# Altium project STM_System_Board.PrjPCB (part 4 of 6)

## Sheet STM_System_Board_Supply.SchDoc
size 420 x 297 mm; EDA_Number: ARTIQ; Author: G.Kasprowicz, P. Kulik; CompanyName: WUT ISE; DrawnBy: G.Kasprowicz, P. Kulik; Organization: WUT ISE; DocumentNumber: 9; SheetNumber: 9; ModifiedBy: -; CheckedDate: -; Title2: Power supply; Designer: G.Kasprowicz, P. Kulik; ModifiedDate: -; ProjectName: Sensor Box
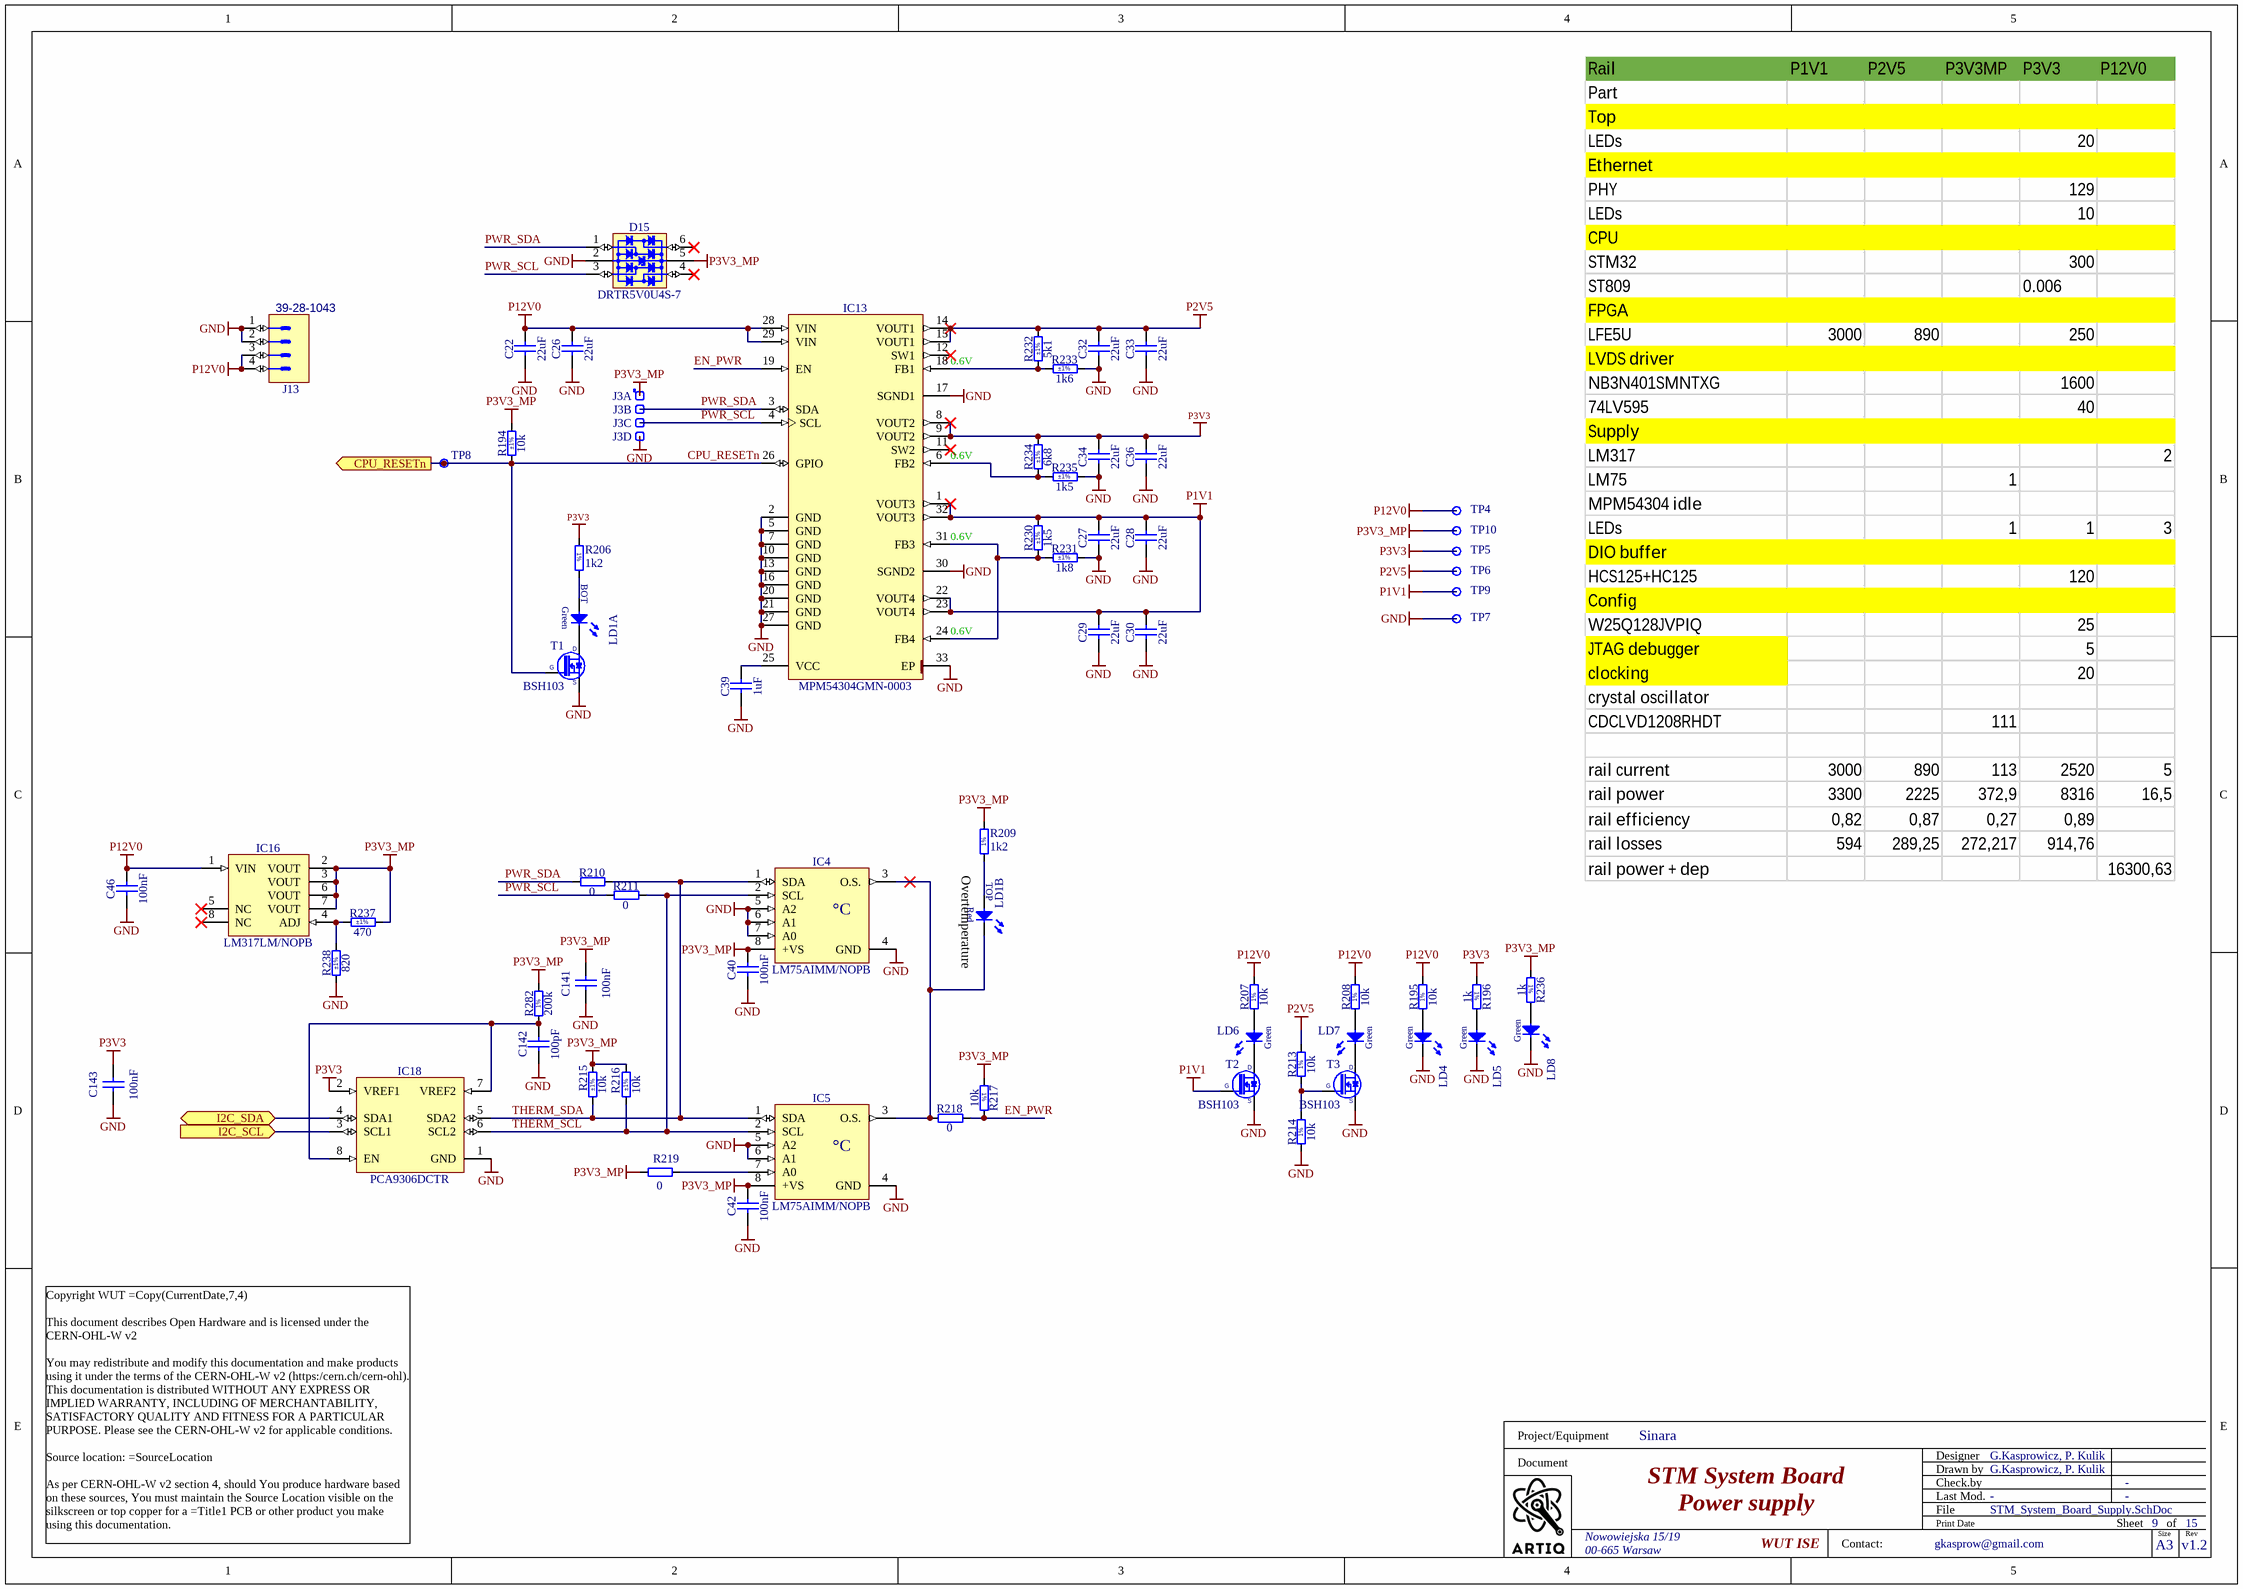
[diagram p6: STM_System_Board_Supply.SchDoc]

### Parts
C22  22uF  [CAPC2012X135N]
C26  22uF  [CAPC2012X135N]
C27  22uF  [CAPC2012X135N]
C28  22uF  [CAPC2012X135N]
C29  22uF  [CAPC2012X135N]
C30  22uF  [CAPC2012X135N]
C32  22uF  [CAPC2012X135N]
C33  22uF  [CAPC2012X135N]
C34  22uF  [CAPC2012X135N]
C36  22uF  [CAPC2012X135N]
C39  1uF  [CAPC1005X55N]
C40  100nF  [CAPC1005X55N]
C42  100nF  [CAPC1005X55N]
C46  100nF  [CAPC1005X55N]
C141  100nF  [CAPC1005X55N]
C142  100pF  [CAPC1005X55N]
C143  100nF  [CAPC1005X55N]
D15  DRTR5V0U4S-7  [SOT65P210X110-6N]
IC4  LM75AIMM/NOPB  [SOP65P490X109-8N]
IC5  LM75AIMM/NOPB  [SOP65P490X109-8N]
IC13  MPM54304GMN-0003  [MPS_MPM54304GMN]
IC16  LM317LM/NOPB  [SOIC127P600X175-8N]
IC18  PCA9306DCTR  [SOP65P400X130-8N]
J3  Header 4  [SAMTEC_HTSW-104-23-L-S]  (value not drawn)  (parts A,B,C,D of 4)
J13  Manufacturer Part Number: 39-28-1043  [MOLEX_39-28-1043]  (hidden comment: Mini-Fit Jr.™)
LD1  Red/Green  [LED_DIALIGHT_571-0112F]  (value not drawn)  (parts A,B of 2)
LD4  Green  [LED_KINGBRIGHT_KPH-1608CGCK]
LD5  Green  [LED_KINGBRIGHT_KPH-1608CGCK]
LD6  Green  [LED_KINGBRIGHT_KPH-1608CGCK]
LD7  Green  [LED_KINGBRIGHT_KPH-1608CGCK]
LD8  Green  [LED_KINGBRIGHT_KPH-1608CGCK]
R194  10k  Tolerance: ±1%  [RESC1005X40N]
R195  10k  [RESC1005X40N]
R196  1k  [RESC1608X55N]
R206  1k2  [RESC1608X55N]
R207  10k  [RESC1005X40N]
R208  10k  [RESC1005X40N]
R209  1k2  [RESC1608X55N]
R210  0  [RESC1005X40N]
R211  0  [RESC1005X40N]
R213  10k  [RESC1005X40N]
R214  10k  [RESC1005X40N]
R215  10k  Tolerance: ±1%  [RESC1005X40N]
R216  10k  Tolerance: ±1%  [RESC1005X40N]
R217  10k  [RESC1005X40N]
R218  0  [RESC1005X40N]
R219  0  [RESC1005X40N]
R230  1k5  Tolerance: ±1%  [RESC1005X40N]
R231  1k8  Tolerance: ±1%  [RESC1005X40N]
R232  5k1  Tolerance: ±1%  [RESC1005X40N]
R233  1k6  Tolerance: ±1%  [RESC1005X40N]
R234  6k8  Tolerance: ±1%  [RESC1005X40N]
R235  1k5  Tolerance: ±1%  [RESC1005X40N]
R236  1k  [RESC1608X55N]
R237  470  Tolerance: ±1%  [RESC1005X40N]
R238  820  Tolerance: ±1%  [RESC1005X40N]
R282  200k  [RESC1005X40N]
T1  BSH103  [SOT95P230X110-3N]
T2  BSH103  [SOT95P230X110-3N]
T3  BSH103  [SOT95P230X110-3N]
TP4  Test Point  [TPS127]  (value not drawn)
TP5  Test Point  [TPS127]  (value not drawn)
TP6  Test Point  [TPS127]  (value not drawn)
TP7  Test Point  [TPS127]  (value not drawn)
TP8  Test Point  [TPS127]  (value not drawn)
TP9  Test Point  [TPS127]  (value not drawn)
TP10  Test Point  [TPS127]  (value not drawn)

### Ports
CPU_RESETn (out), I2C_SCL (in), I2C_SDA (bidir)

### Nets
GND: C22.1 C26.1 C27.1 C28.1 C29.1 C30.1 C32.1 C33.1 C34.1 C36.1 C39.1 C40.1 C42.1 C46.1 C141.1 C142.1 C143.1 D15.2(GND) IC4.4(GND) IC4.5(A2) IC4.6(A1) IC4.7(A0) IC5.4(GND) IC5.5(A2) IC5.6(A1) IC13.2(GND) IC13.5(GND) IC13.7(GND) IC13.10(GND) IC13.13(GND) IC13.16(GND) IC13.17(SGND1) IC13.20(GND) IC13.21(GND) IC13.27(GND) IC13.30(SGND2) IC13.33(EP) IC18.1(GND) J3.4 J13.1 J13.2 LD4.1(C) LD5.1(C) LD8.1(C) R214.1 R231.2 R233.2 R235.2 R238.1 T1.2(S) T2.2(S) T3.2(S) TP7.1
P1V1: C27.2 C28.2 C29.2 C30.2 IC13.1(VOUT3) IC13.22(VOUT4) IC13.23(VOUT4) IC13.32(VOUT3) R230.2 T2.1(G) TP9.1
P2V5: C32.2 C33.2 IC13.14(VOUT1) IC13.15(VOUT1) R213.2 R232.2 TP6.1
P3V3: C34.2 C36.2 C143.2 IC13.8(VOUT2) IC13.9(VOUT2) IC18.2(VREF1) R196.1 R206.1 R234.2 TP5.1
P3V3_MP: C40.2 C42.2 C141.2 D15.5(VBUS) IC4.8(+VS) IC5.8(+VS) IC16.2(VOUT) IC16.3(VOUT) IC16.6(VOUT) IC16.7(VOUT) J3.1 R194.2 R209.2 R215.2 R216.2 R217.1 R219.1 R236.1 R237.2 R282.2 TP10.1
P12V0: C22.2 C26.2 C46.2 IC13.28(VIN) IC13.29(VIN) IC16.1(VIN) J13.3 J13.4 R195.2 R207.2 R208.2 TP4.1
CPU_RESETn: IC13.26(GPIO) R194.1 T1.1(G) TP8.1 ; port CPU_RESETn
EN_PWR: IC13.19(EN) R217.2 R218.2
I2C1_SCL: IC18.3(SCL1) ; port I2C_SCL
I2C1_SDA: IC18.4(SDA1) ; port I2C_SDA
PWR_SCL: D15.3(I/O2) IC13.4(SCL) J3.3 R211.1
PWR_SDA: D15.1(I/O1) IC13.3(SDA) J3.2 R210.1
THERM_SCL: IC4.2(SCL) IC5.2(SCL) IC18.6(SCL2) R211.2 R216.1
THERM_SDA: IC4.1(SDA) IC5.1(SDA) IC18.5(SDA2) R210.2 R215.1
NetC39_2: C39.2 IC13.25(VCC)
NetC142_2: C142.2 IC18.7(VREF2) IC18.8(EN) R282.1
NetIC4_3: IC4.3(O.S.) IC5.3(O.S.) LD1.3(C) R218.1
NetIC5_7: IC5.7(A0) R219.2
NetIC13_6: IC13.6(FB2) R234.1 R235.1
NetIC13_18: IC13.18(FB1) R232.1 R233.1
NetIC13_24: IC13.24(FB4) IC13.31(FB3) R230.1 R231.1
NetIC16_4: IC16.4(ADJ) R237.1 R238.2
NetLD1_1: LD1.1(C) T1.3(D)
NetLD1_2: LD1.2(A) R206.2
NetLD1_4: LD1.4(A) R209.1
NetLD4_2: LD4.2(A) R195.1
NetLD5_2: LD5.2(A) R196.2
NetLD6_1: LD6.1(C) T2.3(D)
NetLD6_2: LD6.2(A) R207.1
NetLD7_1: LD7.1(C) T3.3(D)
NetLD7_2: LD7.2(A) R208.1
NetLD8_2: LD8.2(A) R236.2
NetR213_1: R213.1 R214.2 T3.1(G)

Not connected (* = marked no-connect by the designer): D15 4(I/O3)* 6(I/O4)*; IC13 11(SW2)* 12(SW1)*; IC16 5(NC)* 8(NC)*

### Notes on the sheet
- (near IC13) 0.6V
- (near LD1) Overtemperature
- Project/Equipment
- Document
- Designer
- Drawn by
- Check.by
- Copyright WUT =Copy(CurrentDate,7,4)
  This document describes Open Hardware and is licensed under the CERN-OHL-W v2
  You may redistribute and modify this documentation and make products using it under the terms of the CERN-OHL-W v2 (https:/cern.ch/cern-ohl). This documentation is distributed WITHOUT ANY EXPRESS OR IMPLIED WARRANTY, INCLUDING OF MERCHANTABILITY, SATISFACTORY QUALITY AND FITNESS FOR A PARTICULAR PURPOSE. Please see the CERN-OHL-W v2 for applicable conditions.
  Source location: =SourceLocation
  As per CERN-OHL-W v2 section 4, should You produce hardware based on these sources, You must maintain the Source Location visible on the silkscreen or top copper for a =Title1 PCB or other product you make using this documentation.
- Contact:
- File
- Last Mod.
- Print Date
- Sheet
- Size
- A3
- of
- Rev
- (in symbol LED_DIALIGHT_571-0112F, part A) BOT; Green
- (in symbol LED_DIALIGHT_571-0112F, part B) TOP; Red
- (in symbol LM75AIMM/NOPB) °C
- (in symbol R0402_10K_1%_0.0625W_100PPM) 1%
- (in symbol R0402_10k_1%_0.0625W_100PPM) 1%
- (in symbol R0402_200K_1%_0.0625W_100PPM) 1%
- (in symbol R0603_1K2_1%_0.1W_100PPM) 1%
- (in symbol R0603_1K_1%_0.1W_100PPM) 1%

### Library data of the parts
C22 C26-C30 C32-C34 C36 = CC0805_22UF_16V_10%_X5R: Non-polarised capacitor; Part Description: SMD Multilayer Chip Ceramic Capacitor; Manufacturer: GENERIC; Manufacturer1 Part Number: C2012X5R1C226KT; Voltage: 16V; TC: X5R; Tolerance: ±10%; Part Number: CC0805_22UF_16V_10%_X5R; Component Kind: Standard; Component Type: Standard; Pin Count: 2; Value: 22uF; Status: Preferred; Manufacturer Part Number: CC0805_22UF_16V_10%_X5R; Case: 0805; Mounted: Yes; Socket: No; SMD: Yes; Sense: No; Manufacturer1 Example: TDK; Manufacturer1 ComponentHeight: 1.35mm; HelpURL: \\cern.ch\dfs\Applications\Altium\Datasheets\CC0805_X5R_TDK_C.pdf; Author: CERN DEM JLC; CreateDate: 25.10.2012; LatestRevisionDate: 25.10.2012
C39 = CC0402_1UF_16V_10%_X5R: Non-polarised capacitor; Part Description: SMD Multilayer Chip Ceramic Capacitor; Manufacturer: GENERIC; Manufacturer1 Part Number: C1005X5R1C105KT; Voltage: 16V; TC: X5R; Tolerance: ±10%; Part Number: CC0402_1UF_16V_10%_X5R; Component Kind: Standard; Component Type: Standard; Pin Count: 2; Value: 1uF; Status: Preferred; Manufacturer Part Number: CC0402_1UF_16V_10%_X5R; Case: 0402; Mounted: Yes; Socket: No; SMD: Yes; Sense: No; Manufacturer1 Example: TDK; Manufacturer1 ComponentHeight: 0.55mm; HelpURL: \\cern.ch\dfs\Applications\Altium\Datasheets\CC0402_X5R_TDK_C.pdf; Author: CERN DEM JLC; CreateDate: 2012-10-25; LatestRevisionDate: 2012-10-25
C40 C42 C46 C141 C143 = CC0402_100NF_16V_10%_X5R: Non-polarised capacitor; Part Description: SMD Multilayer Chip Ceramic Capacitor; Manufacturer: GENERIC; Manufacturer1 Part Number: GRM155R61C104KA88D; Voltage: 16V; TC: X5R; Tolerance: ±10%; Part Number: CC0402_100NF_16V_10%_X5R; Component Kind: Standard; Component Type: Standard; Pin Count: 2; Value: 100nF; Status: None; Manufacturer Part Number: CC0402_100NF_16V_10%_X5R; Case: 0402; Mounted: Yes; Socket: No; SMD: Yes; Sense: No; Manufacturer1 Example: MURATA; Manufacturer1 ComponentHeight: 0.55mm; HelpURL: \\cern.ch\dfs\Applications\Altium\Datasheets\CC0402_X5R_MURATA_GRM.pdf; Author: CERN DEM JLC; CreateDate: 10.12.2013; LatestRevisionDate: 10.12.2013
C142 = CC0402_100PF_50V_5%_C0G: Non-polarised capacitor; Part Description: SMD Multilayer Chip Ceramic Capacitor; Manufacturer: GENERIC; Manufacturer1 Part Number: C0402C101J5GACTU; Voltage: 50V; TC: C0G/NP0; Tolerance: ±5%; Part Number: CC0402_100PF_50V_5%_C0G; Component Kind: Standard; Component Type: Standard; Pin Count: 2; Value: 100pF; Status: Preferred; Manufacturer Part Number: CC0402_100PF_50V_5%_C0G; Case: 0402; Mounted: Yes; Socket: No; SMD: Yes; Sense: No; Manufacturer1 Example: KEMET; Manufacturer1 ComponentHeight: 0.55mm; HelpURL: \\cern.ch\dfs\Applications\Altium\Datasheets\CC0805_C0G_KEMET_(Commercial Grade).pdf; Author: CERN DEM JLC; CreateDate: 03.12.2007; LatestRevisionDate: 22.04.2015
D15 = D_TVS_DRTR5V0U4S-7: Integrated Quad Ultra-Low Capacitance ESD Protection; Part Description: Integrated Quad Ultra-Low Capacitance ESD (±8kV) Protection; Manufacturer: DIODES; PressFit: No; Bonding: No; Status Comment: Active; Part Number: DRTR5V0U4S-7; Component Kind: Standard; Component Type: Standard; Device: DRTR5V0U4S-7; PackageDescription: SOT363, SC70-6, 0.65mm Pitch; 6 Pin, 1.25mm W X 2.00mm L X 1.10mm H body, IPC Medium Density; Status: Active; Manufacturer Part Number: DRTR5V0U4S-7; Pin Count: 6; Case: SOT363; Mounted: Yes; Socket: No; SMD: Yes; Sense: No; ComponentHeight: 1.1mm; HelpURL: \\cern.ch\dfs\Applications\Altium\Datasheets\PRTR5V0U4Y.pdf; Author: GK; CreateDate: 24.01.2017; LatestRevisionDate: 14.09.2020
IC4 IC5 = LM75AIMM/NOPB: Digital Temperature Sensor and Thermal Watchdog with Two-Wire Interface; Part Description: -25° to +100°C ±2°C Digital Temperature Sensor and Thermal Watchdog with Two-Wire Interface; Manufacturer: TEXAS INSTRUMENTS; PressFit: No; Bonding: No; Part Number: LM75AIMM/NOPB; Component Kind: Standard; Component Type: Standard; Device: LM75AIMM/NOPB; PackageDescription: SOP, 0.65mm pitch; 8 pin,3.00mm W X 3.00mm L X 1.09mm H bodyI, PC Medium Density; Manufacturer Part Number: LM75AIMM/NOPB; Pin Count: 8; Case: SSOP8; Mounted: Yes; Socket: No; SMD: Yes; Sense: No; ComponentHeight: 1.09mm; HelpURL: \\cern.ch\dfs\Applications\Altium\Datasheets\LM75AIMM-NOPB.pdf; Author: CERN DEM JLC; CreateDate: 15.10.2012; LatestRevisionDate: 15.10.2012
IC13 = MPM54304GMN: Quad-Output Power Module with I2C and MTP; Part Description: 4V to 16V Input, Quad-Output Power Module with I2C and MTP; Manufacturer: MPS (MONOLITIC  POWER SYSTEMS); PressFit: No; Bonding: No; Part Number: MPM54304GMN-0003; Component Kind: Standard; Component Type: Standard; Device: MPM54304GMN-0003; PackageDescription: MPS LGA-33 Case, 0.65mm Pitch, Rect.; 32 Pin, 7.00mm L X 7.00mm W X 2.10mm H body (w/Thermal Tab 3.55 X 3.55mm); Manufacturer Part Number: MPM54304GMN-0003; Pin Count: 33; Case: QFN32; Mounted: Yes; Socket: No; SMD: Yes; Sense: No; ComponentHeight: 2.1mm; HelpURL: \\cern.ch\dfs\Applications\Altium\Datasheets\MPM54304GMN.pdf; Author: CERN DEM BC; CreateDate: 09.11.2020; LatestRevisionDate: 09.11.2020
IC16 = LM317LM/NOPB: 1.2V to 37V, 100mA Adjustable Positive Regulator; Part Description: 1.2V to 37V, 100mA Adjustable Positive Voltage Regulator; Manufacturer: TEXAS INSTRUMENTS; PressFit: No; Bonding: No; Part Number: LM317LM/NOPB; Component Kind: Standard; Component Type: Standard; Device: LM317LM/NOPB; PackageDescription: SOIC 8, Pitch 1.27mm, Body 4x5mm, IPC Medium Density; Manufacturer Part Number: LM317LM/NOPB; Pin Count: 8; Case: SOIC8; Mounted: Yes; Socket: No; SMD: Yes; Sense: No; ComponentHeight: 1.75mm; HelpURL: \\cern.ch\dfs\Applications\Altium\Datasheets\LM317LM-NOPB.pdf; Author: CERN DEM JLC; CreateDate: 12.04.2012; LatestRevisionDate: 16.09.2014
IC18 = PCA9306DCTR: Dual Bidirectional I2C Bus And SMBus Voltage-Level Translator; Manufacturer: TEXAS INSTRUMENTS; PressFit: No; Bonding: No; Part Number: PCA9306DCTR; Component Kind: Standard; Component Type: Standard; Device: PCA9306DCTR; PackageDescription: SOP, 0.65mm, Pitch; 8 Pin, 2.80mm W X 2.95mm L X 1.30mm H Body, PC Medium Density; Part Description: Dual Bidirectional I2C Bus And SMBus Voltage-Level Translator; Manufacturer Part Number: PCA9306DCTR; Pin Count: 8; Case: SSOP8; Mounted: Yes; Socket: No; SMD: Yes; Sense: No; ComponentHeight: 1.3mm; Author: CERN DEM JLC; HelpURL: \\cern.ch\dfs\Applications\Altium\Datasheets\PCA9306DCTR.pdf; CreateDate: 25.02.2013; LatestRevisionDate: 11.02.2016
J3 = SAMTEC_HTSW-104-23-L-S: 4 Mini Wire-Wrap Contact Strip Header; Part Description: 4 Contacts, Pitch 2.54mm, Single Row  Through Mount Straight Header (Post Lead 5.84mm, Tail Lead 2.92mm, Insulator 2.54mm); Manufacturer: SAMTEC; PressFit: No; Status Comment: High Temperature; Part Number: SAMTEC_HTSW-104-23-L-S; Component Kind: Standard; Component Type: Standard; Pin Count: 4; Family: Header 4; Mounted: Yes; Socket: No; SMD: No; Sense: No; Status: Preferred; Manufacturer Part Number: HTSW-104-23-L-S; ComponentHeight: 8.38mm; HelpURL: \\cern.ch\dfs\Applications\Altium\Datasheets\SAMTEC_HTSW-104-23-L-S.pdf; Author: CERN DEM JLC; CreateDate: 2018-02-22; LatestRevisionDate: 2018-02-22
J13 = MOLEX_39-28-1043: Connector 4 Male; Manufacturer: MOLEX; Part Description: 4.20mm (.165") Pitch Mini-Fit Jr.™ Header, Dual Row, Vertical, without Snap-in Plastic Peg PCB Lock, 4 Circuits; PressFit: No; Part Number: MOLEX_39-28-1043; Component Kind: Standard; Component Type: Standard; Pin Count: 4; Family: Mini-Fit Jr.™; Mounted: Yes; Socket: No; SMD: No; Sense: No; Status: None; ComponentHeight: 13.1mm; HelpURL: \\cern.ch\dfs\Applications\Altium\Datasheets\MOLEX_39-28-1043.pdf; Author: CERN DEM JLC; CreateDate: 12.03.2009; LatestRevisionDate: 06.03.2012
LD1 = LED_DIALIGHT_571-0112F: 2x LED  Botom Green, Top Red; Part Description: Dual 2mm  LEDs, Red Top,Green Bot, CBI® Circuit Board Indicator (Without positioning pins); PressFit: No; Bonding: No; Part Number: LED_DIALIGHT_571-0112F; Component Kind: Standard; Component Type: Standard; Color: Red/Green; PackageDescription: 2x 2mm LED (Top: Red, Bot: Green) PCB Edge Mounting (Without positioning pins) DIALIGHT 571 Serie; Manufacturer: DIALIGHT; Manufacturer Part Number: 571-0112F; Pin Count: 4; Mounted: Yes; Socket: No; SMD: No; Sense: No; ComponentHeight: 8.6mm; HelpURL: \\cern.ch\dfs\Applications\Altium\Datasheets\LED_DIALIGHT_571-0112F.pdf; Author: CERN DEM JLC; CreateDate: 09.11.2009; LatestRevisionDate: 17.03.2010
LD4-LD8 = LED_KINGBRIGHT_KPH-1608CGCK: LED Green 1C 2A; Part Description: SMD Green LED, Case 1.6mmX0.8mm(0603), 0.65mm Thickness; PressFit: No; Bonding: No; Part Number: LED_KINGBRIGHT_KPH-1608CGCK; Component Kind: Standard; Component Type: Standard; Color: Green; PackageDescription: SMT Green LED, Case 0603, Body L 1.6 x W 0.8mm H 0.65mm; Manufacturer: KINGBRIGHT; Manufacturer Part Number: KPH-1608CGCK; Pin Count: 2; Mounted: Yes; Socket: No; SMD: Yes; Sense: No; ComponentHeight: 0.65mm; HelpURL: \\cern.ch\dfs\Applications\Altium\Datasheets\LED_KINGBRIGHT_KPH-1608CGCK.pdf; Author: CERN DEM JLC
  LD4 LD5 LD8: CreateDate: 03/07/2017; LatestRevisionDate: 03/07/2017
  LD6 LD7: CreateDate: 03.07.2017; LatestRevisionDate: 03.07.2017
R194 R195 R215-R217 = R0402_10K_1%_0.0625W_100PPM: Resistor - 1%; Part Description: General Purpose Thick Film Chip Resistor; Manufacturer: GENERIC; Manufacturer1 Part Number: 232270671003L; TC: ±100ppm/°C; PressFit: No; Part Number: R0402_10K_1%_0.0625W_100PPM; Component Kind: Standard; Component Type: Standard; Pin Count: 2; Value: 10k; Status: Not Recommended; Power: 0.0625W; Manufacturer Part Number: R0402_10K_1%_0.0625W_100PPM; Case: 0402; Mounted: Yes; Sense: No; Socket: No; SMD: Yes; Manufacturer1 Example: YAGEO PHYCOMP; Manufacturer1 ComponentHeight: 0.4mm; HelpURL: \\cern.ch\dfs\Applications\Altium\Datasheets\R0402_Phycomp_RC0402.pdf; Author: CERN DEM JLC
  R194: CreateDate: 03.12.2007; LatestRevisionDate: 17.10.2012
  R195 R217: Tolerance: ±1%; CreateDate: 03.12.2007; LatestRevisionDate: 17.10.2012
  R215 R216: CreateDate: 2007-12-03; LatestRevisionDate: 2012-10-17
R196 R236 = R0603_1K_1%_0.1W_100PPM: Resistor - 1%; Part Description: General Purpose Thick Film Chip Resistor; Manufacturer: GENERIC; Manufacturer1 Part Number: NRC06F1001TRF; Power: 0.1W; TC: ±100ppm/°C; PressFit: No; Part Number: R0603_1K_1%_0.1W_100PPM; Component Kind: Standard; Component Type: Standard; Pin Count: 2; Value: 1k; Status: Preferred; Tolerance: ±1%; Manufacturer Part Number: R0603_1K_1%_0.1W_100PPM; Case: 0603; Mounted: Yes; Sense: No; Socket: No; SMD: Yes; Manufacturer1 Example: NIC COMPONENT; Manufacturer1 ComponentHeight: 0.55mm; HelpURL: \\cern.ch\dfs\Applications\Altium\Datasheets\R0603_NIC_NRC.pdf; Author: CERN DEM JLC; CreateDate: 03.12.2007; LatestRevisionDate: 13.03.2008
R206 R209 = R0603_1K2_1%_0.1W_100PPM: Resistor - 1%; Part Description: General Purpose Thick Film Chip Resistor; Manufacturer: GENERIC; Manufacturer1 Part Number: NRC06F1201TRF; Power: 0.1W; TC: ±100ppm/°C; Part Number: R0603_1K2_1%_0.1W_100PPM; Component Kind: Standard; Component Type: Standard; Pin Count: 2; Value: 1k2; Status: Preferred; Tolerance: ±1%; Manufacturer Part Number: R0603_1K2_1%_0.1W_100PPM; Case: 0603; Mounted: Yes; Sense: No; Socket: No; SMD: Yes; Manufacturer1 Example: NIC COMPONENT; Manufacturer1 ComponentHeight: 0.55mm; HelpURL: \\cern.ch\dfs\Applications\Altium\Datasheets\R0603_NIC_NRC.pdf; Author: CERN DEM JLC; CreateDate: 03.12.2007; LatestRevisionDate: 13.03.2008
R207 R208 R213 R214 = R0402_10k_1%_0.0625W_100PPM: Resistor - 1%; Part Description: General Purpose Thick Film Chip Resistor; Manufacturer: GENERIC; Manufacturer1 Part Number: 232270671003L; TC: ±100ppm/°C; PressFit: No; Part Number: R0402_10K_1%_0.0625W_100PPM; Component Kind: Standard; Component Type: Standard; Pin Count: 2; Value: 10k; Status: Not Recommended; Power: 0.0625W; Tolerance: ±1%; Manufacturer Part Number: R0402_10K_1%_0.0625W_100PPM; Case: 0402; Mounted: Yes; Sense: No; Socket: No; SMD: Yes; Manufacturer1 Example: YAGEO PHYCOMP; Manufacturer1 ComponentHeight: 0.4mm; HelpURL: \\cern.ch\dfs\Applications\Altium\Datasheets\R0402_Phycomp_RC0402.pdf; Author: CERN DEM JLC; CreateDate: 03.12.2007; LatestRevisionDate: 17.10.2012
R210 R211 = R0402_0R_JUMPER: Resistor; Part Description: 1A (0.05R Max DC Resistance) Zero Ohm Jumper; Manufacturer: GENERIC; Manufacturer1 Part Number: 232270591001L; PressFit: No; Part Number: R0402_0R_JUMPER; Component Kind: Standard; Component Type: Standard; Pin Count: 2; Value: 0; Status: Not Recommended; Manufacturer Part Number: R0402_0R_JUMPER; Case: 0402; Mounted: Yes; Sense: No; Socket: No; SMD: Yes; Manufacturer1 Example: YAGEO PHYCOMP; Manufacturer1 ComponentHeight: 0.4mm; HelpURL: \\cern.ch\dfs\Applications\Altium\Datasheets\R0402_Phycomp_RC0402.pdf; Author: CERN DEM JLC; CreateDate: 03.12.2007; LatestRevisionDate: 17.10.2012
R218 R219 = R0402_0R_JUMPER: Resistor; Part Description: 1A (0.05R Max DC Resistance) Zero Ohm Jumper; Manufacturer: GENERIC; Manufacturer1 Part Number: 232270591001L; Part Number: R0402_0R_JUMPER; Component Kind: Standard; Component Type: Standard; Pin Count: 2; Value: 0; Status: Not recommended; Manufacturer Part Number: R0402_0R_JUMPER; Case: 0402; Mounted: Yes; Sense: No; Socket: No; SMD: Yes; Manufacturer1 Example: YAGEO PHYCOMP; Manufacturer1 ComponentHeight: 0.4mm; HelpURL: \\cern.ch\dfs\Applications\Altium\Datasheets\R0402_Phycomp_RC0402.pdf; Author: CERN DEM JLC; CreateDate: 03.12.2007; LatestRevisionDate: 17.10.2012
R230 R235 = R0402_1K5_1%_0.0625W_100PPM: Resistor - 1%; Part Description: General Purpose Thick Film Chip Resistor; Manufacturer: GENERIC; Manufacturer1 Part Number: 232270671502L; TC: ±100ppm/°C; PressFit: No; Part Number: R0402_1K5_1%_0.0625W_100PPM; Component Kind: Standard; Component Type: Standard; Pin Count: 2; Value: 1k5; Status: Not Recommended; Power: 0.0625W; Manufacturer Part Number: R0402_1K5_1%_0.0625W_100PPM; Case: 0402; Mounted: Yes; Sense: No; Socket: No; SMD: Yes; Manufacturer1 Example: YAGEO PHYCOMP; Manufacturer1 ComponentHeight: 0.4mm; HelpURL: \\cern.ch\dfs\Applications\Altium\Datasheets\R0402_Phycomp_RC0402.pdf; Author: CERN DEM JLC; CreateDate: 03.12.2007; LatestRevisionDate: 17.10.2012
R231 = R0402_1K8_1%_0.0625W_100PPM: Resistor - 1%; Part Description: General Purpose Thick Film Chip Resistor; Manufacturer: GENERIC; Manufacturer1 Part Number: 232270671802L; TC: ±100ppm/°C; PressFit: No; Part Number: R0402_1K8_1%_0.0625W_100PPM; Component Kind: Standard; Component Type: Standard; Pin Count: 2; Value: 1k8; Status: Not Recommended; Power: 0.0625W; Manufacturer Part Number: R0402_1K8_1%_0.0625W_100PPM; Case: 0402; Mounted: Yes; Sense: No; Socket: No; SMD: Yes; Manufacturer1 Example: YAGEO PHYCOMP; Manufacturer1 ComponentHeight: 0.4mm; HelpURL: \\cern.ch\dfs\Applications\Altium\Datasheets\R0402_Phycomp_RC0402.pdf; Author: CERN DEM JLC; CreateDate: 03.12.2007; LatestRevisionDate: 17.10.2012
R232 = R0402_5K1_1%_0.0625W_100PPM: Resistor - 1%; Part Description: General Purpose Thick Film Chip Resistor; Manufacturer: GENERIC; Manufacturer1 Part Number: 232270675102L; TC: ±100ppm/°C; PressFit: No; Part Number: R0402_5K1_1%_0.0625W_100PPM; Component Kind: Standard; Component Type: Standard; Pin Count: 2; Value: 5k1; Status: Not Recommended; Power: 0.0625W; Manufacturer Part Number: R0402_5K1_1%_0.0625W_100PPM; Case: 0402; Mounted: Yes; Sense: No; Socket: No; SMD: Yes; Manufacturer1 Example: YAGEO PHYCOMP; Manufacturer1 ComponentHeight: 0.4mm; HelpURL: \\cern.ch\dfs\Applications\Altium\Datasheets\R0402_Phycomp_RC0402.pdf; Author: CERN DEM JLC; CreateDate: 03.12.2007; LatestRevisionDate: 17.10.2012
R233 = R0402_1K6_1%_0.0625W_100PPM: Resistor - 1%; Part Description: General Purpose Thick Film Chip Resistor; Manufacturer: GENERIC; Manufacturer1 Part Number: 232270671602L; TC: ±100ppm/°C; PressFit: No; Part Number: R0402_1K6_1%_0.0625W_100PPM; Component Kind: Standard; Component Type: Standard; Pin Count: 2; Value: 1k6; Status: Not Recommended; Power: 0.0625W; Manufacturer Part Number: R0402_1K6_1%_0.0625W_100PPM; Case: 0402; Mounted: Yes; Sense: No; Socket: No; SMD: Yes; Manufacturer1 Example: YAGEO PHYCOMP; Manufacturer1 ComponentHeight: 0.4mm; HelpURL: \\cern.ch\dfs\Applications\Altium\Datasheets\R0402_Phycomp_RC0402.pdf; Author: CERN DEM JLC; CreateDate: 03.12.2007; LatestRevisionDate: 17.10.2012
R234 = R0402_6K8_1%_0.0625W_100PPM: Resistor - 1%; Part Description: General Purpose Thick Film Chip Resistor; Manufacturer: GENERIC; Manufacturer1 Part Number: 232270676802L; TC: ±100ppm/°C; PressFit: No; Part Number: R0402_6K8_1%_0.0625W_100PPM; Component Kind: Standard; Component Type: Standard; Pin Count: 2; Value: 6k8; Status: Not Recommended; Power: 0.0625W; Manufacturer Part Number: R0402_6K8_1%_0.0625W_100PPM; Case: 0402; Mounted: Yes; Sense: No; Socket: No; SMD: Yes; Manufacturer1 Example: YAGEO PHYCOMP; Manufacturer1 ComponentHeight: 0.4mm; HelpURL: \\cern.ch\dfs\Applications\Altium\Datasheets\R0402_Phycomp_RC0402.pdf; Author: CERN DEM JLC; CreateDate: 03.12.2007; LatestRevisionDate: 17.10.2012
R237 = R0402_470R_1%_0.0625W_100PPM: Resistor - 1%; Part Description: General Purpose Thick Film Chip Resistor; Manufacturer: GENERIC; Manufacturer1 Part Number: 232270674701L; TC: ±100ppm/°C; PressFit: No; Part Number: R0402_470R_1%_0.0625W_100PPM; Component Kind: Standard; Component Type: Standard; Pin Count: 2; Value: 470; Status: Not Recommended; Power: 0.0625W; Manufacturer Part Number: R0402_470R_1%_0.0625W_100PPM; Case: 0402; Mounted: Yes; Sense: No; Socket: No; SMD: Yes; Manufacturer1 Example: YAGEO PHYCOMP; Manufacturer1 ComponentHeight: 0.4mm; HelpURL: \\cern.ch\dfs\Applications\Altium\Datasheets\R0402_Phycomp_RC0402.pdf; Author: CERN DEM JLC; CreateDate: 03.12.2007; LatestRevisionDate: 17.10.2012
R238 = R0402_820R_1%_0.0625W_100PPM: Resistor - 1%; Part Description: General Purpose Thick Film Chip Resistor; Manufacturer: GENERIC; Manufacturer1 Part Number: 232270678201L; TC: ±100ppm/°C; PressFit: No; Part Number: R0402_820R_1%_0.0625W_100PPM; Component Kind: Standard; Component Type: Standard; Pin Count: 2; Value: 820; Status: Not Recommended; Power: 0.0625W; Manufacturer Part Number: R0402_820R_1%_0.0625W_100PPM; Case: 0402; Mounted: Yes; Sense: No; Socket: No; SMD: Yes; Manufacturer1 Example: YAGEO PHYCOMP; Manufacturer1 ComponentHeight: 0.4mm; HelpURL: \\cern.ch\dfs\Applications\Altium\Datasheets\R0402_Phycomp_RC0402.pdf; Author: CERN DEM JLC; CreateDate: 03.12.2007; LatestRevisionDate: 17.10.2012
R282 = R0402_200K_1%_0.0625W_100PPM: Resistor - 1%; Part Description: General Purpose Thick Film Chip Resistor; Manufacturer: GENERIC; Manufacturer1 Part Number: 232270672004L; TC: ±100ppm/°C; PressFit: No; Part Number: R0402_200K_1%_0.0625W_100PPM; Component Kind: Standard; Component Type: Standard; Pin Count: 2; Value: 200k; Status: Not Recommended; Power: 0.0625W; Tolerance: ±1%; Manufacturer Part Number: R0402_200K_1%_0.0625W_100PPM; Case: 0402; Mounted: Yes; Sense: No; Socket: No; SMD: Yes; Manufacturer1 Example: YAGEO PHYCOMP; Manufacturer1 ComponentHeight: 0.4mm; HelpURL: \\cern.ch\dfs\Applications\Altium\Datasheets\R0402_Phycomp_RC0402.pdf; Author: CERN DEM JLC; CreateDate: 03.12.2007; LatestRevisionDate: 17.10.2012
T1-T3 = BSH103: N-CHANNEL MOSFET WITH DIODE; Part Description: 30V 850mA N-Channel Enhancement Mode Field-Effect Transistor; Manufacturer: NEXPERIA; PressFit: No; Bonding: No; Part Number: BSH103; Component Kind: Standard; Component Type: Standard; Device: BSH103; PackageDescription: SOT23, 3 pin, Pitch 0.95mm - 1.3mm W X 2.9mm L X 1.1mm H, IPC Medium Density; Manufacturer Part Number: BSH103; Pin Count: 3; Case: SOT23-3; Mounted: Yes; Socket: No; SMD: Yes; Sense: No; ComponentHeight: 1.1mm; HelpURL: \\cern.ch\dfs\Applications\Altium\Datasheets\BSH103.pdf; Author: CERN DEM JLC; CreateDate: 16.03.2010; LatestRevisionDate: 20.06.2017
TP4-TP10 = SMD_PAD_1.27X1.27MM: Part Description: 1.27mm x 1.27mm PCB Copper Area (SMD Test Point); Mounted: No; Part Number: SMD_PAD_1.27X1.27MM; Component Kind: Standard (No BOM); Component Type: Standard (No BOM); Pin Count: 1; Family: Test Point; Socket: No; SMD: Yes; Sense: No; Status: None; ComponentHeight: 0mm; HelpURL: Undefined; Author: CERN DEM JLC; CreateDate: 12.01.2008; LatestRevisionDate: 12.01.2008; PackageDescription: 1.27mm x 1.27mm PCB Copper Area (SMD Test Point)

## Sheet ST_SYS_Board_FPGA_SUP.schdoc
size 420 x 297 mm; EDA_Number: ARTIQ; Author: G.Kasprowicz; CompanyName: WUT ISE; DrawnBy: G.Kasprowicz; Organization: WUT ISE; DocumentNumber: 10; SheetNumber: 10; ModifiedBy: -; CheckedDate: -; Title2: FPGA supply; Designer: G.Kasprowicz; ModifiedDate: -; ProjectName: Sensor Box
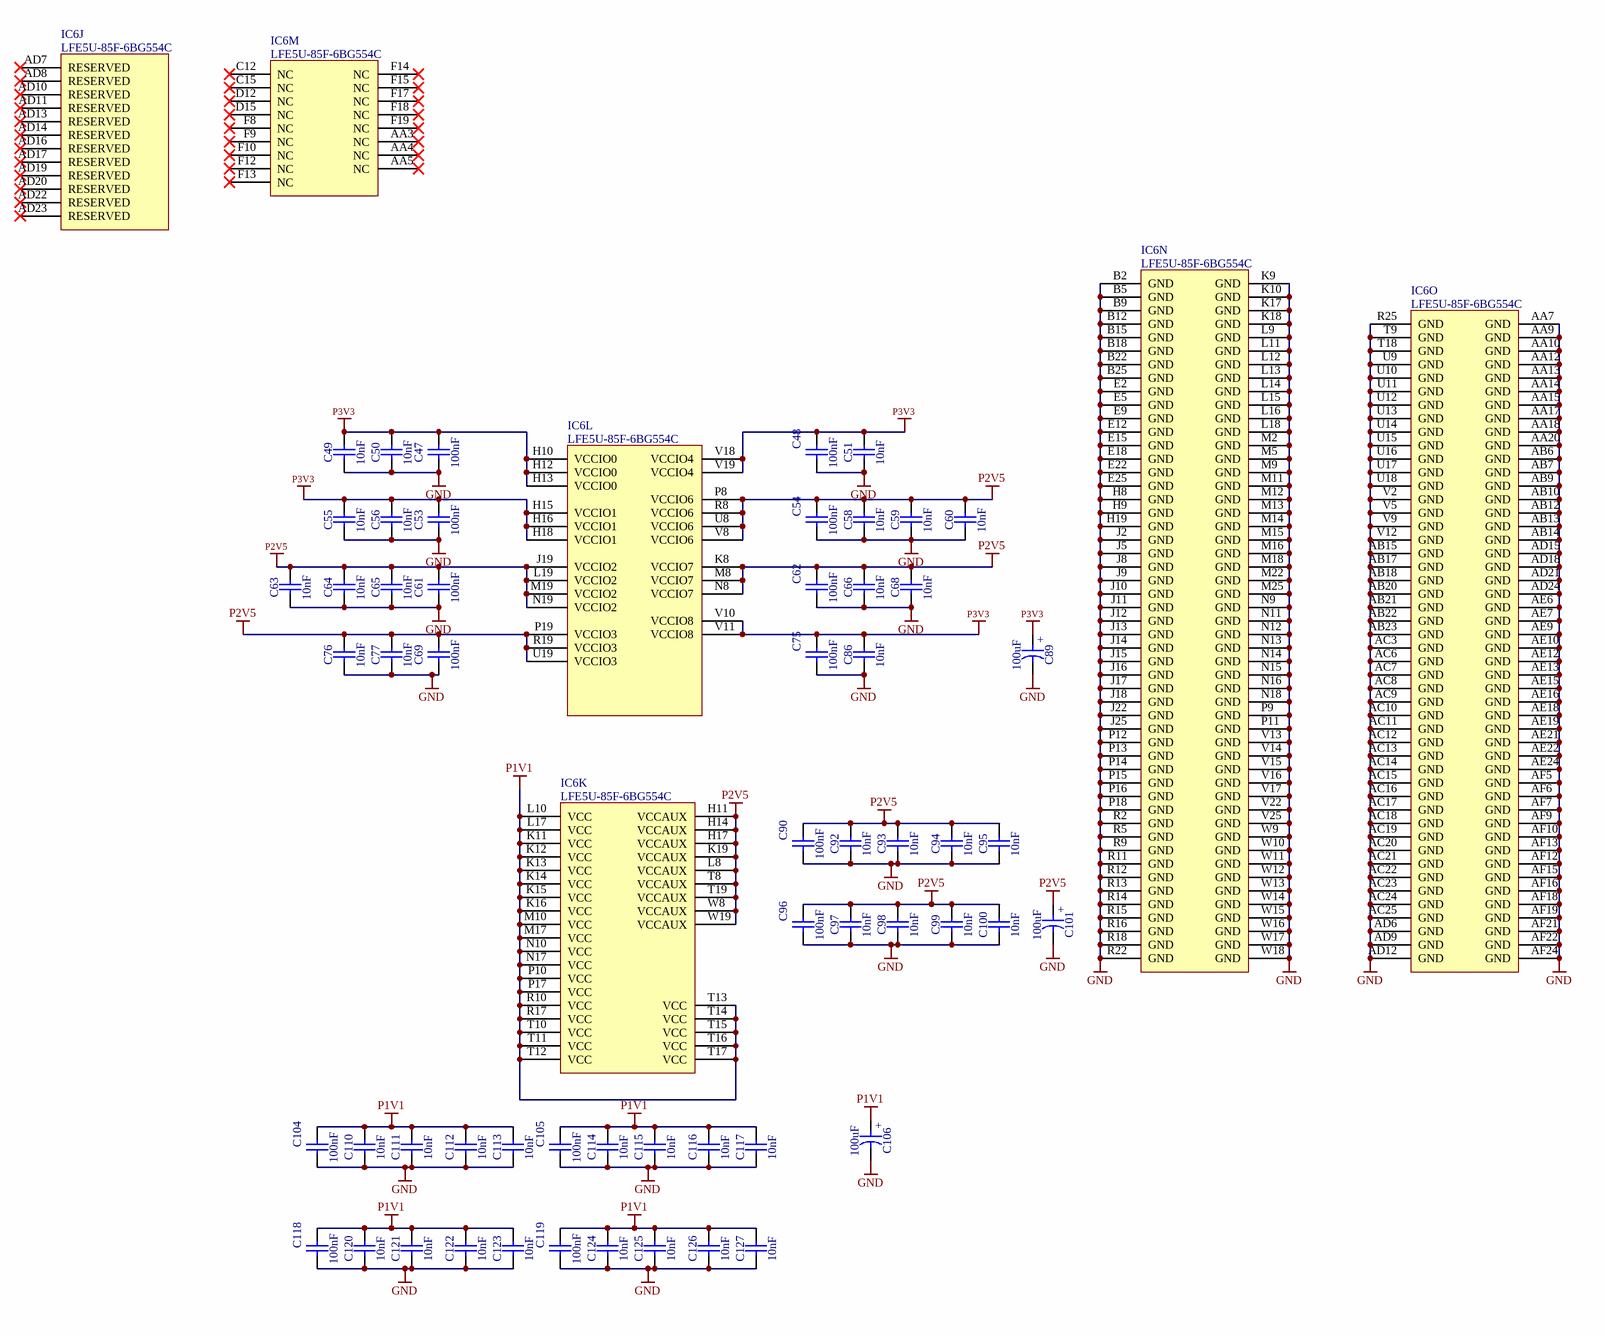
[diagram p7: ST_SYS_Board_FPGA_SUP.schdoc]

### Parts
C47  100nF  [CAPC1005X55N]
C48  100nF  [CAPC1005X55N]
C49  10nF  [CAPC0603X33N]
C50  10nF  [CAPC0603X33N]
C51  10nF  [CAPC0603X33N]
C53  100nF  [CAPC1005X55N]
C54  100nF  [CAPC1005X55N]
C55  10nF  [CAPC0603X33N]
C56  10nF  [CAPC0603X33N]
C58  10nF  [CAPC0603X33N]
C59  10nF  [CAPC0603X33N]
C60  10nF  [CAPC0603X33N]
C61  100nF  [CAPC1005X55N]
C62  100nF  [CAPC1005X55N]
C63  10nF  [CAPC0603X33N]
C64  10nF  [CAPC0603X33N]
C65  10nF  [CAPC0603X33N]
C66  10nF  [CAPC0603X33N]
C68  10nF  [CAPC0603X33N]
C69  100nF  [CAPC1005X55N]
C75  100nF  [CAPC1005X55N]
C76  10nF  [CAPC0603X33N]
C77  10nF  [CAPC0603X33N]
C86  10nF  [CAPC0603X33N]
C89  100uF  [CAPMP3528X210N]
C90  100nF  [CAPC1005X55N]
C92  10nF  [CAPC0603X33N]
C93  10nF  [CAPC0603X33N]
C94  10nF  [CAPC0603X33N]
C95  10nF  [CAPC0603X33N]
C96  100nF  [CAPC1005X55N]
C97  10nF  [CAPC0603X33N]
C98  10nF  [CAPC0603X33N]
C99  10nF  [CAPC0603X33N]
C100  10nF  [CAPC0603X33N]
C101  100uF  [CAPMP3528X210N]
C104  100nF  [CAPC1005X55N]
C105  100nF  [CAPC1005X55N]
C106  100uF  [CAPMP3528X210N]
C110  10nF  [CAPC0603X33N]
C111  10nF  [CAPC0603X33N]
C112  10nF  [CAPC0603X33N]
C113  10nF  [CAPC0603X33N]
C114  10nF  [CAPC0603X33N]
C115  10nF  [CAPC0603X33N]
C116  10nF  [CAPC0603X33N]
C117  10nF  [CAPC0603X33N]
C118  100nF  [CAPC1005X55N]
C119  100nF  [CAPC1005X55N]
C120  10nF  [CAPC0603X33N]
C121  10nF  [CAPC0603X33N]
C122  10nF  [CAPC0603X33N]
C123  10nF  [CAPC0603X33N]
C124  10nF  [CAPC0603X33N]
C125  10nF  [CAPC0603X33N]
C126  10nF  [CAPC0603X33N]
C127  10nF  [CAPC0603X33N]
IC6  LFE5U-85F-6BG554C  [BGA554C80P26X26_2300X2300X176]  (parts J,K,L,M,N,O of 15)

### Nets
GND: C47.1 C48.1 C49.1 C50.1 C51.1 C53.1 C54.1 C55.1 C56.1 C58.1 C59.1 C60.1 C61.1 C62.1 C63.1 C64.1 C65.1 C66.1 C68.1 C69.1 C75.1 C76.1 C77.1 C86.1 C89.2 C90.1 C92.1 C93.1 C94.1 C95.1 C96.1 C97.1 C98.1 C99.1 C100.1 C101.2 C104.1 C105.1 C106.2 C110.1 C111.1 C112.1 C113.1 C114.1 C115.1 C116.1 C117.1 C118.1 C119.1 C120.1 C121.1 C122.1 C123.1 C124.1 C125.1 C126.1 C127.1 IC6.AA7(GND) IC6.AA9(GND) IC6.AA10(GND) IC6.AA12(GND) IC6.AA13(GND) IC6.AA14(GND) IC6.AA15(GND) IC6.AA17(GND) IC6.AA18(GND) IC6.AA20(GND) IC6.AB6(GND) IC6.AB7(GND) IC6.AB9(GND) IC6.AB10(GND) IC6.AB12(GND) IC6.AB13(GND) IC6.AB14(GND) IC6.AB15(GND) IC6.AB17(GND) IC6.AB18(GND) IC6.AB20(GND) IC6.AB21(GND) IC6.AB22(GND) IC6.AB23(GND) IC6.AC3(GND) IC6.AC6(GND) IC6.AC7(GND) IC6.AC8(GND) IC6.AC9(GND) IC6.AC10(GND) IC6.AC11(GND) IC6.AC12(GND) IC6.AC13(GND) IC6.AC14(GND) IC6.AC15(GND) IC6.AC16(GND) IC6.AC17(GND) IC6.AC18(GND) IC6.AC19(GND) IC6.AC20(GND) IC6.AC21(GND) IC6.AC22(GND) IC6.AC23(GND) IC6.AC24(GND) IC6.AC25(GND) IC6.AD6(GND) IC6.AD9(GND) IC6.AD12(GND) IC6.AD15(GND) IC6.AD18(GND) IC6.AD21(GND) IC6.AD24(GND) IC6.AE6(GND) IC6.AE7(GND) IC6.AE9(GND) IC6.AE10(GND) IC6.AE12(GND) IC6.AE13(GND) IC6.AE15(GND) IC6.AE16(GND) IC6.AE18(GND) IC6.AE19(GND) IC6.AE21(GND) IC6.AE22(GND) IC6.AE24(GND) IC6.AF5(GND) IC6.AF6(GND) IC6.AF7(GND) IC6.AF9(GND) IC6.AF10(GND) IC6.AF12(GND) IC6.AF13(GND) IC6.AF15(GND) IC6.AF16(GND) IC6.AF18(GND) IC6.AF19(GND) IC6.AF21(GND) IC6.AF22(GND) IC6.AF24(GND) IC6.B2(GND) IC6.B5(GND) IC6.B9(GND) IC6.B12(GND) IC6.B15(GND) IC6.B18(GND) IC6.B22(GND) IC6.B25(GND) IC6.E2(GND) IC6.E5(GND) IC6.E9(GND) IC6.E12(GND) IC6.E15(GND) IC6.E18(GND) IC6.E22(GND) IC6.E25(GND) IC6.H8(GND) IC6.H9(GND) IC6.H19(GND) IC6.J2(GND) IC6.J5(GND) IC6.J8(GND) IC6.J9(GND) IC6.J10(GND) IC6.J11(GND) IC6.J12(GND) IC6.J13(GND) IC6.J14(GND) IC6.J15(GND) IC6.J16(GND) IC6.J17(GND) IC6.J18(GND) IC6.J22(GND) IC6.J25(GND) IC6.K9(GND) IC6.K10(GND) IC6.K17(GND) IC6.K18(GND) IC6.L9(GND) IC6.L11(GND) IC6.L12(GND) IC6.L13(GND) IC6.L14(GND) IC6.L15(GND) IC6.L16(GND) IC6.L18(GND) IC6.M2(GND) IC6.M5(GND) IC6.M9(GND) IC6.M11(GND) IC6.M12(GND) IC6.M13(GND) IC6.M14(GND) IC6.M15(GND) IC6.M16(GND) IC6.M18(GND) IC6.M22(GND) IC6.M25(GND) IC6.N9(GND) IC6.N11(GND) IC6.N12(GND) IC6.N13(GND) IC6.N14(GND) IC6.N15(GND) IC6.N16(GND) IC6.N18(GND) IC6.P9(GND) IC6.P11(GND) IC6.P12(GND) IC6.P13(GND) IC6.P14(GND) IC6.P15(GND) IC6.P16(GND) IC6.P18(GND) IC6.R2(GND) IC6.R5(GND) IC6.R9(GND) IC6.R11(GND) IC6.R12(GND) IC6.R13(GND) IC6.R14(GND) IC6.R15(GND) IC6.R16(GND) IC6.R18(GND) IC6.R22(GND) IC6.R25(GND) IC6.T9(GND) IC6.T18(GND) IC6.U9(GND) IC6.U10(GND) IC6.U11(GND) IC6.U12(GND) IC6.U13(GND) IC6.U14(GND) IC6.U15(GND) IC6.U16(GND) IC6.U17(GND) IC6.U18(GND) IC6.V2(GND) IC6.V5(GND) IC6.V9(GND) IC6.V12(GND) IC6.V13(GND) IC6.V14(GND) IC6.V15(GND) IC6.V16(GND) IC6.V17(GND) IC6.V22(GND) IC6.V25(GND) IC6.W9(GND) IC6.W10(GND) IC6.W11(GND) IC6.W12(GND) IC6.W13(GND) IC6.W14(GND) IC6.W15(GND) IC6.W16(GND) IC6.W17(GND) IC6.W18(GND)
P1V1: C104.2 C105.2 C106.1 C110.2 C111.2 C112.2 C113.2 C114.2 C115.2 C116.2 C117.2 C118.2 C119.2 C120.2 C121.2 C122.2 C123.2 C124.2 C125.2 C126.2 C127.2 IC6.K11(VCC) IC6.K12(VCC) IC6.K13(VCC) IC6.K14(VCC) IC6.K15(VCC) IC6.K16(VCC) IC6.L10(VCC) IC6.L17(VCC) IC6.M10(VCC) IC6.M17(VCC) IC6.N10(VCC) IC6.N17(VCC) IC6.P10(VCC) IC6.P17(VCC) IC6.R10(VCC) IC6.R17(VCC) IC6.T10(VCC) IC6.T11(VCC) IC6.T12(VCC) IC6.T13(VCC) IC6.T14(VCC) IC6.T15(VCC) IC6.T16(VCC) IC6.T17(VCC)
P2V5: C54.2 C58.2 C59.2 C60.2 C61.2 C62.2 C63.2 C64.2 C65.2 C66.2 C68.2 C69.2 C76.2 C77.2 C90.2 C92.2 C93.2 C94.2 C95.2 C96.2 C97.2 C98.2 C99.2 C100.2 C101.1 IC6.H11(VCCAUX) IC6.H14(VCCAUX) IC6.H17(VCCAUX) IC6.J19(VCCIO2) IC6.K8(VCCIO7) IC6.K19(VCCAUX) IC6.L8(VCCAUX) IC6.L19(VCCIO2) IC6.M8(VCCIO7) IC6.M19(VCCIO2) IC6.N8(VCCIO7) IC6.N19(VCCIO2) IC6.P8(VCCIO6) IC6.P19(VCCIO3) IC6.R8(VCCIO6) IC6.R19(VCCIO3) IC6.T8(VCCAUX) IC6.T19(VCCAUX) IC6.U8(VCCIO6) IC6.U19(VCCIO3) IC6.V8(VCCIO6) IC6.W8(VCCAUX) IC6.W19(VCCAUX)
P3V3: C47.2 C48.2 C49.2 C50.2 C51.2 C53.2 C55.2 C56.2 C75.2 C86.2 C89.1 IC6.H10(VCCIO0) IC6.H12(VCCIO0) IC6.H13(VCCIO0) IC6.H15(VCCIO1) IC6.H16(VCCIO1) IC6.H18(VCCIO1) IC6.V10(VCCIO8) IC6.V11(VCCIO8) IC6.V18(VCCIO4) IC6.V19(VCCIO4)

Not connected (* = marked no-connect by the designer): IC6 AA3(NC)* AA4(NC)* AA5(NC)* AD7(RESERVED)* AD8(RESERVED)* AD10(RESERVED)* AD11(RESERVED)* AD13(RESERVED)* AD14(RESERVED)* AD16(RESERVED)* AD17(RESERVED)* AD19(RESERVED)* AD20(RESERVED)* AD22(RESERVED)* AD23(RESERVED)* C12(NC)* C15(NC)* D12(NC)* D15(NC)* F8(NC)* F9(NC)* F10(NC)* F12(NC)* F13(NC)* F14(NC)* F15(NC)* F17(NC)* F18(NC)* F19(NC)*

### Notes on the sheet
- Project/Equipment
- Document
- Designer
- Drawn by
- Check.by
- Copyright WUT =Copy(CurrentDate,7,4)
  This document describes Open Hardware and is licensed under the CERN-OHL-W v2
  You may redistribute and modify this documentation and make products using it under the terms of the CERN-OHL-W v2 (https:/cern.ch/cern-ohl). This documentation is distributed WITHOUT ANY EXPRESS OR IMPLIED WARRANTY, INCLUDING OF MERCHANTABILITY, SATISFACTORY QUALITY AND FITNESS FOR A PARTICULAR PURPOSE. Please see the CERN-OHL-W v2 for applicable conditions.
  Source location: =SourceLocation
  As per CERN-OHL-W v2 section 4, should You produce hardware based on these sources, You must maintain the Source Location visible on the silkscreen or top copper for a =Title1 PCB or other product you make using this documentation.
- Contact:
- File
- Last Mod.
- Print Date
- Sheet
- Size
- A3
- of
- Rev
- (in symbol CTE3528-21_100UF_6.3V_20%_LESR015_KEMET_T520) +

### Library data of the parts
C47 C48 C53 C54 C61 C62 C69 C75 C90 C96 C104 C105 C118 C119 = CC0402_100NF_16V_10%_X5R: as C40 on sheet STM_System_Board_Supply; Part Number: CC0402_100NF_16V_10%_X5R; Component Kind: Standard; Component Type: Standard; Pin Count: 2; Value: 100nF; Status: None; Manufacturer Part Number: CC0402_100NF_16V_10%_X5R; Case: 0402; Mounted: Yes; Socket: No; SMD: Yes; Sense: No; Manufacturer1 Example: MURATA; Manufacturer1 ComponentHeight: 0.55mm; HelpURL: \\cern.ch\dfs\Applications\Altium\Datasheets\CC0402_X5R_MURATA_GRM.pdf; Author: CERN DEM JLC; CreateDate: 10.12.2013; LatestRevisionDate: 10.12.2013
C49-C51 C55 C56 C58-C60 C63-C66 C68 C76 C77 C86 C92-C95 C97-C100 C110-C117 C120-C127 = CC0201_10NF_10V_10%_X5R: Non-polarised capacitor; Part Description: SMD Multilayer Chip Ceramic Capacitor; Manufacturer: GENERIC; Manufacturer1 Part Number: 0201ZD103KAT2A; Voltage: 10V; TC: X5R; Tolerance: ±10%; Part Number: CC0201_10NF_10V_10%_X5R; Component Kind: Standard; Component Type: Standard; Pin Count: 2; Value: 10nF; Status: Not Recommended; Manufacturer Part Number: CC0201_10NF_10V_10%_X5R; Case: 0201; Mounted: Yes; Socket: No; SMD: Yes; Sense: No; Manufacturer1 Example: AVX; Manufacturer1 ComponentHeight: 0.33mm; HelpURL: \\cern.ch\dfs\Applications\Altium\Datasheets\CC0201_X5R_AVX.pdf; Author: CERN DEM JLC; CreateDate: 03.12.2007; LatestRevisionDate: 03.12.2007
C89 C101 C106 = CTE3528-21_100UF_6.3V_20%_LESR015_KEMET_T520: Polarised capacitor; Part Description: Low ESR 0R015 Tantalum Chip Capacitor; Manufacturer: KEMET; Manufacturer Part Number: T520B107M006ATE015; Voltage: 6.3V; Tolerance: ±20%; Part Number: CTE3528-21_100UF_6.3V_20%_LESR015_KEMET_T520; Component Kind: Standard; Component Type: Standard; Pin Count: 2; Value: 100uF; Status: None; Case: B; Mounted: Yes; Socket: No; SMD: Yes; Sense: No; ComponentHeight: 2.1mm; HelpURL: \\cern.ch\dfs\Applications\Altium\Datasheets\CTE-LESR_KEMET_T520.pdf; Author: CERN DEM BC; CreateDate: 31.01.2022; LatestRevisionDate: 31.01.2022
IC6 = LFE5U-85F-6BG554C: Part Description: FPGA LatticeECP5 Family 84000 Cells 40nm Technology 1.1V 554-Pin CABGA Tray; Manufacturer: LATTICE SEMICONDUCTOR; PressFit: No; Bonding: No; Part Number: LFE5U-85F-6BG554C; Component Kind: Standard; Component Type: Standard; Device: LFE5U-85F-6BG554C; PackageDescription: BGA, 0.80mm Pitch, Square; 554Pin, 26 Columns X 26 Rows, 23mm X 23mm X 1.76mm H; Manufacturer Part Number: LFE5U-85F-6BG554C; Pin Count: 554; Case: BGA554; Mounted: Yes; Socket: No; SMD: Yes; Sense: No; ComponentHeight: 1.76mm; HelpURL: \\cern.ch\dfs\Applications\Altium\Datasheets\LFE5U-85F-6BG554C.pdf; ComponentLink1URL: \\cern.ch\dfs\Applications\Altium\Datasheets\LATTICE_Package.pdf; ComponentLink1Description: Package Drawing; ComponentLink2URL: \\cern.ch\dfs\Applications\Altium\Datasheets\LFE5U-85F-6BG554C_Pinout.pdf; ComponentLink2Description: Pinout; Author: CERN DEM HF; CreateDate: 18.02.2022; LatestRevisionDate: 18.02.2022

## Sheet DIO_buffer.schdoc
size 420 x 297 mm; EDA_Number: ARTIQ; Author: G.Kasprowicz; CompanyName: WUT ISE; DrawnBy: G.Kasprowicz; Organization: WUT ISE; DocumentNumber: 11; SheetNumber: 11; ModifiedBy: -; CheckedDate: -; Title2: DIO buffers; Designer: G.Kasprowicz; ModifiedDate: -; ProjectName: Sensor Box
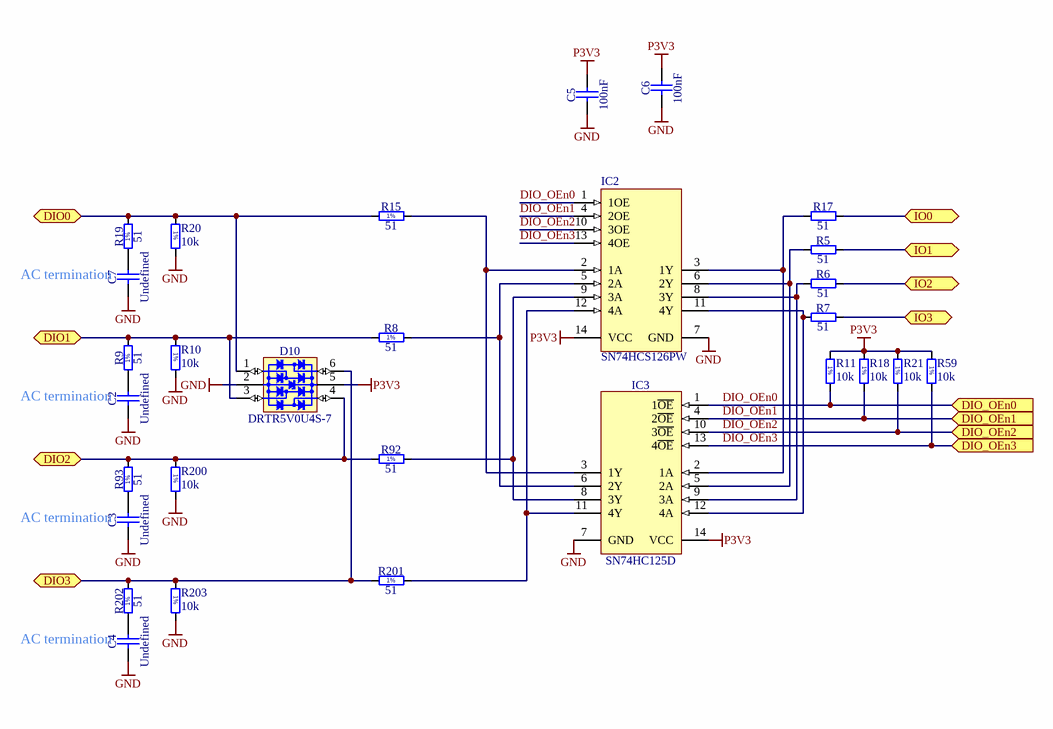
[diagram p8: DIO_buffer.schdoc]

### Parts
C2  Undefined  [CAPC1608X90N]
C3  Undefined  [CAPC1608X90N]
C4  Undefined  [CAPC1608X90N]
C5  100nF  [CAPC1005X55N]
C6  100nF  [CAPC1005X55N]
C7  Undefined  [CAPC1608X90N]
D10  DRTR5V0U4S-7  [SOT65P210X110-6N]
IC2  SN74HCS126PW  [SOP65P640X120-14N]
IC3  SN74HC125D  [SOIC127P600X175-14N]
R5  51  [RESC1005X40N]
R6  51  [RESC1005X40N]
R7  51  [RESC1005X40N]
R8  51  [RESC1005X40N]
R9  51  [RESC1005X40N]
R10  10k  [RESC1005X40N]
R11  10k  [RESC1005X40N]
R15  51  [RESC1005X40N]
R17  51  [RESC1005X40N]
R18  10k  [RESC1005X40N]
R19  51  [RESC1005X40N]
R20  10k  [RESC1005X40N]
R21  10k  [RESC1005X40N]
R59  10k  [RESC1005X40N]
R92  51  [RESC1005X40N]
R93  51  [RESC1005X40N]
R200  10k  [RESC1005X40N]
R201  51  [RESC1005X40N]
R202  51  [RESC1005X40N]
R203  10k  [RESC1005X40N]

### Ports
DIO0 (bidir), DIO1 (bidir), DIO2 (bidir), DIO3 (bidir), DIO_OEn0 (in), DIO_OEn1 (in), DIO_OEn2 (in), DIO_OEn3 (in), IO0 (bidir), IO1 (bidir), IO2 (bidir), IO3 (bidir)

### Nets
GND: C2.1 C3.1 C4.1 C5.1 C6.1 C7.1 D10.2(GND) IC2.7(GND) IC3.7(GND) R10.2 R20.2 R200.2 R203.2
P3V3: C5.2 C6.2 D10.5(VBUS) IC2.14(VCC) IC3.14(VCC) R11.1 R18.1 R21.1 R59.1
DIO_OEn0: IC2.1(1OE) IC3.1(1~{OE}) R11.2 ; port DIO_OEn0
DIO_OEn1: IC2.4(2OE) IC3.4(2~{OE}) R18.2 ; port DIO_OEn1
DIO_OEn2: IC2.10(3OE) IC3.10(3~{OE}) R21.2 ; port DIO_OEn2
DIO_OEn3: IC2.13(4OE) IC3.13(4~{OE}) R59.2 ; port DIO_OEn3
IO0: R17.2 ; port IO0
IO1: R5.2 ; port IO1
IO2: R6.2 ; port IO2
IO3: R7.2 ; port IO3
NetC2_2: C2.2 R9.1
NetC3_2: C3.2 R93.1
NetC4_2: C4.2 R202.1
NetC7_2: C7.2 R19.1
NetD10_1: D10.1(I/O1) R15.1 R19.2 R20.1 ; port DIO0
NetD10_3: D10.3(I/O2) R8.1 R9.2 R10.1 ; port DIO1
NetD10_4: D10.4(I/O3) R92.1 R93.2 R200.1 ; port DIO2
NetD10_6: D10.6(I/O4) R201.1 R202.2 R203.1 ; port DIO3
NetIC2_2: IC2.2(1A) IC3.3(1Y) R15.2
NetIC2_3: IC2.3(1Y) IC3.2(1A) R17.1
NetIC2_5: IC2.5(2A) IC3.6(2Y) R8.2
NetIC2_6: IC2.6(2Y) IC3.5(2A) R5.1
NetIC2_8: IC2.8(3Y) IC3.9(3A) R6.1
NetIC2_9: IC2.9(3A) IC3.8(3Y) R92.2
NetIC2_11: IC2.11(4Y) IC3.12(4A) R7.1
NetIC2_12: IC2.12(4A) IC3.11(4Y) R201.2

### Notes on the sheet
- (near C7) AC termination
- (near C2) AC termination
- (near C3) AC termination
- (near C4) AC termination
- Project/Equipment
- Document
- Designer
- Drawn by
- Check.by
- Copyright WUT =Copy(CurrentDate,7,4)
  This document describes Open Hardware and is licensed under the CERN-OHL-W v2
  You may redistribute and modify this documentation and make products using it under the terms of the CERN-OHL-W v2 (https:/cern.ch/cern-ohl). This documentation is distributed WITHOUT ANY EXPRESS OR IMPLIED WARRANTY, INCLUDING OF MERCHANTABILITY, SATISFACTORY QUALITY AND FITNESS FOR A PARTICULAR PURPOSE. Please see the CERN-OHL-W v2 for applicable conditions.
  Source location: =SourceLocation
  As per CERN-OHL-W v2 section 4, should You produce hardware based on these sources, You must maintain the Source Location visible on the silkscreen or top copper for a =Title1 PCB or other product you make using this documentation.
- Contact:
- File
- Last Mod.
- Print Date
- Sheet
- Size
- A3
- of
- Rev
- (in symbol R0402_10K_1%_0.0625W_100PPM) 1%
- (in symbol R0402_51R_1%_0.0625W_100PPM) 1%

### Library data of the parts
C2-C4 C7 = CC0603_NO-VALUE: Non-polarised capacitor; Part Description: Reserved Footprint For 0603(1608) Chip Ceramic Capacitor; Mounted: No; Part Number: CC0603_NO-VALUE; Component Kind: Standard; Component Type: Standard; Pin Count: 2; Value: Undefined; Status: None; Manufacturer: Undefined; Manufacturer Part Number: CC0603_NO-VALUE; Case: 0603; Socket: No; SMD: Yes; Sense: No; Manufacturer1 ComponentHeight: 0.9mm; HelpURL: Undefined; Author: CERN DEM MR; CreateDate: 22.11.2016; LatestRevisionDate: 22.11.2016
C5 C6 = CC0402_100NF_16V_10%_X5R: as C40 on sheet STM_System_Board_Supply; Part Number: CC0402_100NF_16V_10%_X5R; Component Kind: Standard; Component Type: Standard; Pin Count: 2; Value: 100nF; Status: None; Manufacturer Part Number: CC0402_100NF_16V_10%_X5R; Case: 0402; Mounted: Yes; Socket: No; SMD: Yes; Sense: No; Manufacturer1 Example: MURATA; Manufacturer1 ComponentHeight: 0.55mm; HelpURL: \\cern.ch\dfs\Applications\Altium\Datasheets\CC0402_X5R_MURATA_GRM.pdf; Author: CERN DEM JLC; CreateDate: 10.12.2013; LatestRevisionDate: 10.12.2013
D10 = D_TVS_DRTR5V0U4S-7: as D15 on sheet STM_System_Board_Supply; Part Number: DRTR5V0U4S-7; Component Kind: Standard; Component Type: Standard; Device: DRTR5V0U4S-7; PackageDescription: SOT363, SC70-6, 0.65mm Pitch; 6 Pin, 1.25mm W X 2.00mm L X 1.10mm H body, IPC Medium Density; Status: Active; Manufacturer Part Number: DRTR5V0U4S-7; Pin Count: 6; Case: SOT363; Mounted: Yes; Socket: No; SMD: Yes; Sense: No; ComponentHeight: 1.1mm; HelpURL: \\cern.ch\dfs\Applications\Altium\Datasheets\PRTR5V0U4Y.pdf; Author: GK; CreateDate: 24.01.2017; LatestRevisionDate: 14.09.2020
IC2 = SN74HCS126PW: Quadruple Bus Buffer with 3-State Outputs; Part Description: Quadruple Buffer with 3-State Outputs and Schmitt-Trigger Inputs; Manufacturer: TEXAS INSTRUMENTS; PressFit: No; Bonding: No; Part Number: SN74HCS126PW; Component Kind: Standard; Component Type: Standard; Device: SN74HCS126PW; PackageDescription: SOP, 0.65mm Pitch; 14 Pin, 4.40mm W X 5.00mm L X 1.20mm H body, IPC Medium Density; Manufacturer Part Number: SN74HCS126PW; Pin Count: 14; Case: TSSOP14; Mounted: Yes; Socket: No; SMD: Yes; Sense: No; ComponentHeight: 1.2mm; Author: CERN DEM BC; HelpURL: \\cern.ch\dfs\Applications\Altium\Datasheets\SN74HCS126PW.pdf; CreateDate: 08.12.2020; LatestRevisionDate: 08.12.2020
IC3 = SN74HC125D: Quadruple Bus Buffer with 3-State Outputs; Manufacturer: TEXAS INSTRUMENTS; PressFit: No; Bonding: No; Part Number: SN74HC125D; Component Kind: Standard; Component Type: Standard; Device: SN74HC125D; PackageDescription: SOIC 14, Pitch 1.27mm - Body 4x8.75mm, IPC Medium Density; Part Description: Quadruple Bus Buffer with 3-State Outputs; Manufacturer Part Number: SN74HC125D; Pin Count: 14; Case: SOIC14; Mounted: Yes; Socket: No; SMD: Yes; Sense: No; ComponentHeight: 1.75mm; Author: CERN DEM JLC; HelpURL: \\cern.ch\dfs\Applications\Altium\Datasheets\SN74HC125D.pdf; CreateDate: 30.06.2011; LatestRevisionDate: 30.06.2011
R5-R9 R15 R17 R19 R92 R93 R201 R202 = R0402_51R_1%_0.0625W_100PPM: Resistor - 1%; Part Description: General Purpose Thick Film Chip Resistor; Manufacturer: GENERIC; Manufacturer1 Part Number: 232270675109L; TC: ±100ppm/°C; PressFit: No; Part Number: R0402_51R_1%_0.0625W_100PPM; Component Kind: Standard; Component Type: Standard; Pin Count: 2; Value: 51; Status: Not Recommended; Power: 0.0625W; Tolerance: ±1%; Manufacturer Part Number: R0402_51R_1%_0.0625W_100PPM; Case: 0402; Mounted: Yes; Sense: No; Socket: No; SMD: Yes; Manufacturer1 Example: YAGEO PHYCOMP; Manufacturer1 ComponentHeight: 0.4mm; HelpURL: \\cern.ch\dfs\Applications\Altium\Datasheets\R0402_Phycomp_RC0402.pdf; Author: CERN DEM JLC
  R5-R7 R17: CreateDate: 03.12.2007; LatestRevisionDate: 17.10.2012
  R8 R9 R15 R19 R92 R93 R201 R202: CreateDate: 03/12/2007; LatestRevisionDate: 17/10/2012
R10 R11 R18 R20 R21 R59 R200 R203 = R0402_10K_1%_0.0625W_100PPM: Resistor - 1%; Part Description: General Purpose Thick Film Chip Resistor; Manufacturer: GENERIC; Manufacturer1 Part Number: 232270671003L; TC: ±100ppm/°C; Part Number: R0402_10K_1%_0.0625W_100PPM; Component Kind: Standard; Component Type: Standard; Pin Count: 2; Value: 10k; Status: Not recommended; Power: 0.0625W; Tolerance: ±1%; Manufacturer Part Number: R0402_10K_1%_0.0625W_100PPM; Case: 0402; Mounted: Yes; Sense: No; Socket: No; SMD: Yes; Manufacturer1 Example: YAGEO PHYCOMP; Manufacturer1 ComponentHeight: 0.4mm; HelpURL: \\cern.ch\dfs\Applications\Altium\Datasheets\R0402_Phycomp_RC0402.pdf; Author: CERN DEM JLC; CreateDate: 03.12.2007; LatestRevisionDate: 17.10.2012